# EAGLE design DigitalIO (EAGLE 7.7.0)
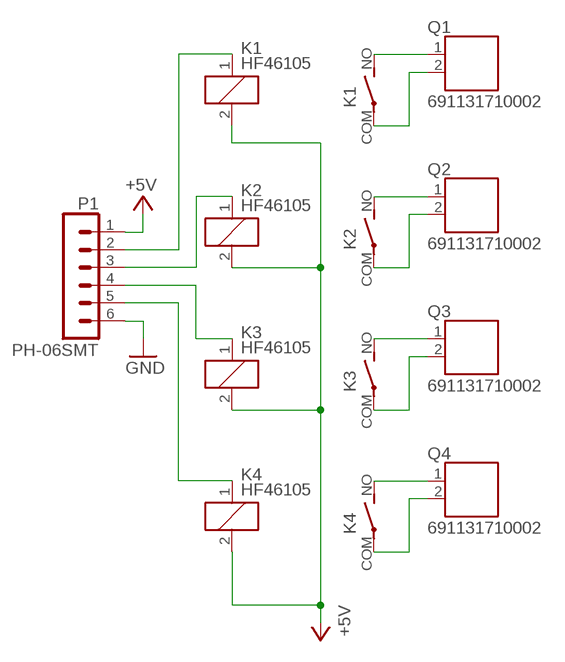
[diagram p0: schematic, sheet 1]

## Parts
K1  HF46105  [HF46]
K2  HF46105  [HF46]
K3  HF46105  [HF46]
K4  HF46105  [HF46]
P1  PH-06SMT  [S6B-PH-SM4]
Q1  691131710002  [691131710002]
Q2  691131710002  [691131710002]
Q3  691131710002  [691131710002]
Q4  691131710002  [691131710002]

## Nets
+5V: K1.2 K2.2 K3.2 K4.2 P1.1
GND: P1.6
N$2: K2.1 P1.3
N$4: K4.1 P1.5
N$5: K1.1 P1.2
N$6: K1.NO(2:S) Q1.1
N$7: K1.COM(2:P) Q1.2
N$8: K2.NO(2:S) Q2.1
N$9: K2.COM(2:P) Q2.2
N$10: K3.NO(2:S) Q3.1
N$11: K3.COM(2:P) Q3.2
N$12: K4.NO(2:S) Q4.1
N$13: K4.COM(2:P) Q4.2
N$14: K3.1 P1.4

## Library data of the parts
K1-K4 = hongfa:HF46?*: Slim Power Relay NAiS Source: http://www.hongfa.com/pro/pdf/HF46F_en.pdf; OC_FARNELL: unknown; OC_NEWARK: unknown
P1 = con-jst-ph:PH-06: HEADER
Q1-Q4 = con-wuerth:691131710002: WR-TBL Terminal block - CUU5/2 CUU5/2GR - 2 Pins;=>Code : Con_TBL_Screw_PClamp_5.00_6911317100xx_691131710002 <http://katalog.we-online.de/media/images/eican/Con_TBL_Screw_PClamp_5.00_6911317100xx_pf2.jpg> Details see: http://katalog.we-online.de/em/datasheet/6911317100xx.pdf Created 11/23/2014, Karrer Zheng 2014 (C) Wurth Elektronik

## Board
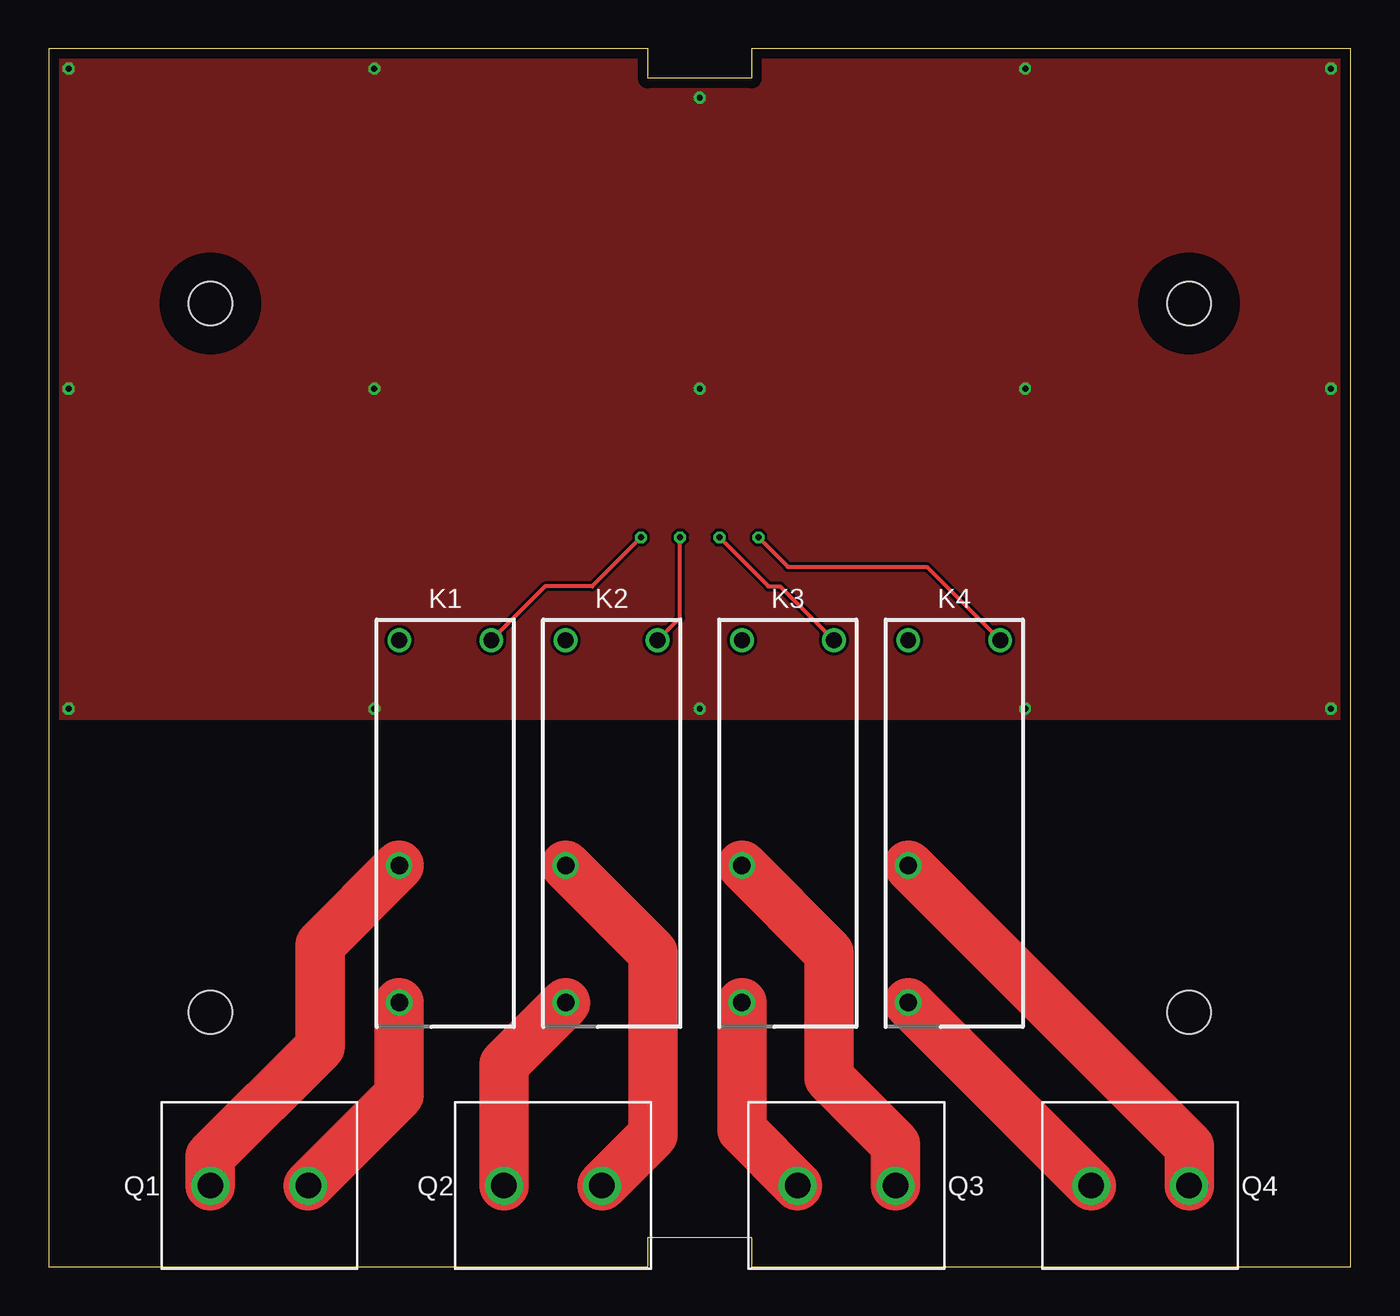
[diagram p1: board, top side]
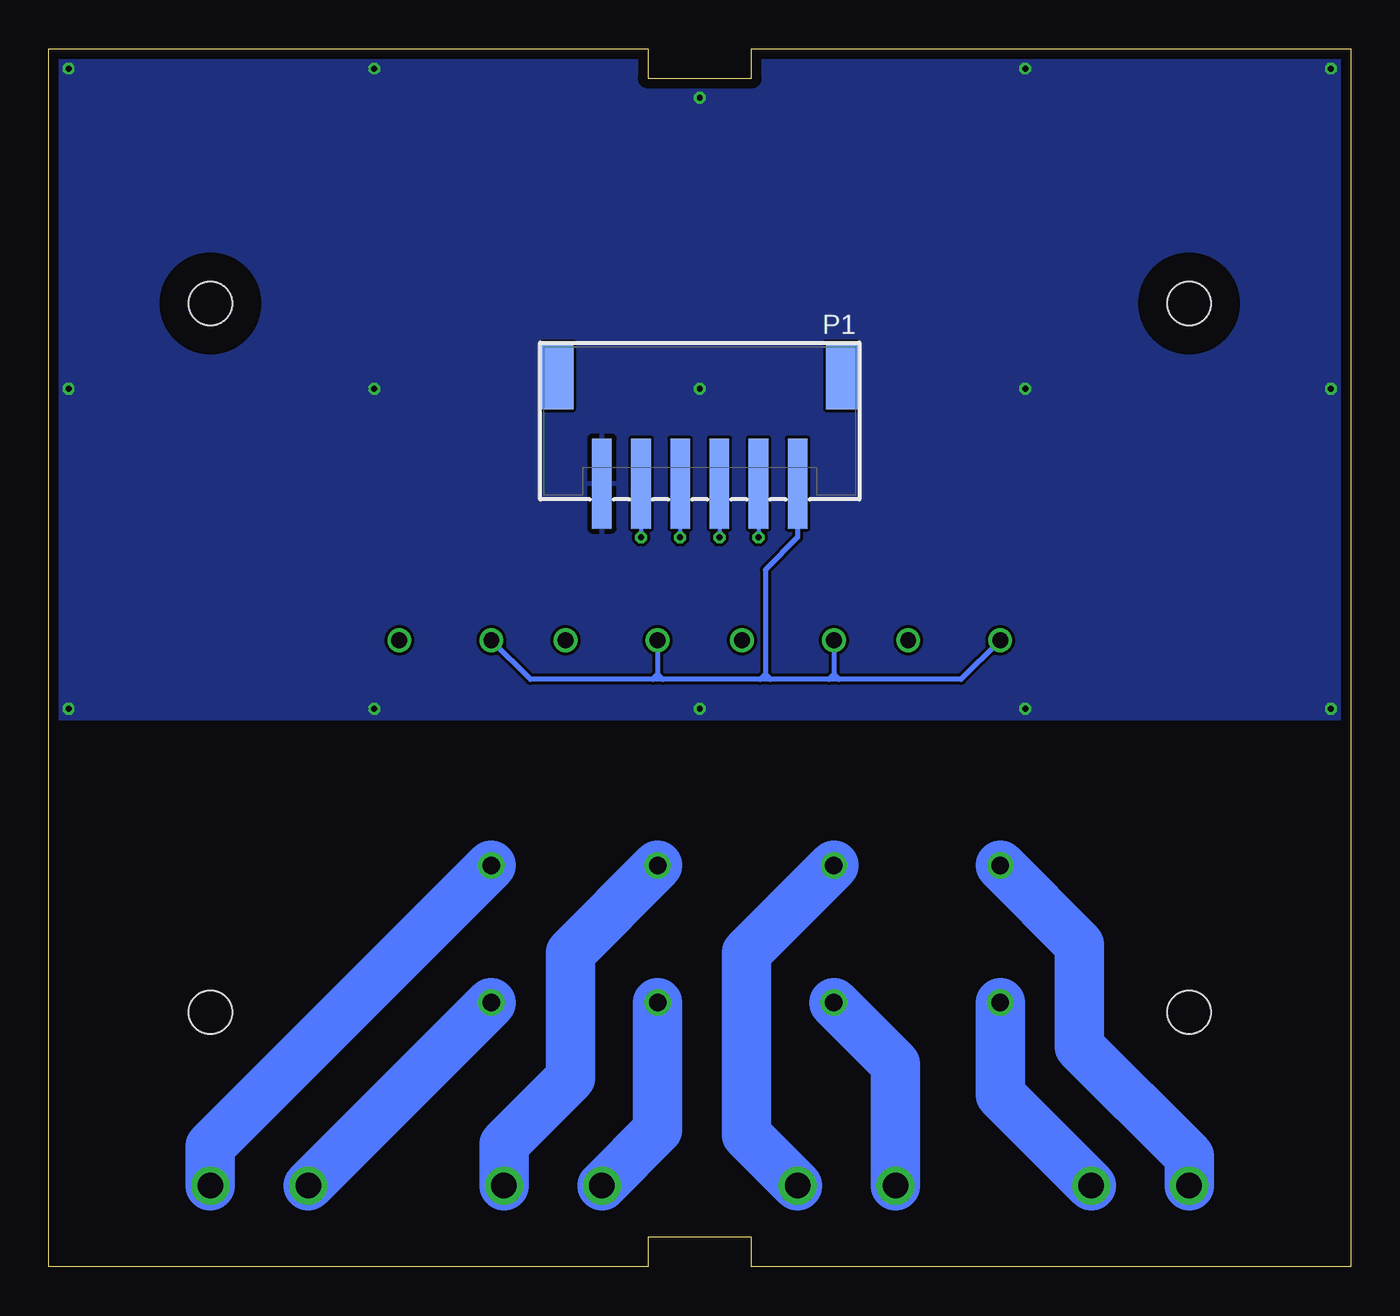
[diagram p2: board, bottom side, seen from below]

Size 66.5 x 62.2 mm. Coordinates in mm from the lower left corner, seen from the top.
Outline: 0,0 30.6,0 30.6,1.5 35.9,1.5 35.9,0 66.5,0 66.5,62.2 35.9,62.2 35.9,60.7 30.6,60.7 30.6,62.2 0,62.2 0,0
Copper layers (1*16): Top 0.035mm / dielectric 1.6mm / Bottom 0.035mm
Design rules "Elecrow *": minimum track width 6mil, minimum drill 12mil, track to track 6mil, track to pad 6mil, pad to pad 6mil, via to via 8mil, smd to smd 0mil, copper to edge 20mil, drill to drill 10mil, minimum pad ring 6mil, minimum via ring 6mil, stop-mask expansion 0mil, vias tented up to drill 100mil, thermal gap 10mil
Holes 2.2 mm at 8.25,49.2 58.25,13 8.25,13 58.25,49.2
tRestrict: area 5.7,10.4 to 10.8,15.6; area 55.6,10.4 to 60.9,15.6; area 55.6,46.6 to 60.9,51.8; area 5.7,46.6 to 10.8,51.8; 8 lines
bRestrict: area 5.7,10.4 to 10.8,15.6; area 55.6,10.4 to 60.9,15.6; area 55.6,46.6 to 60.9,51.8; area 5.7,46.6 to 10.8,51.8; 4 lines

### Footprints (pad centres in the part's own frame; a part is rotated, then mirrored left to right if it is on the bottom)
HF46 = drill 0.813: 1 -9.35,2.35; 2 -9.35,-2.35 | drill 0.889: COM 2.15,-2.35 | drill 0.9: NO 9.15,-2.35
S6B-PH-SM4 = smd 1 x 4.6: 1 -5,1; 2 -3,1; 3 -1,1; 4 1,1; 5 3,1; 6 5,1 | smd 1.6 x 3.4: NC1 -7.25,-4.5; NC2 7.25,-4.5
691131710002 = drill 1.3: 1 -2.5,0; 2 2.5,0

### Placement (x,y rotation side)
K1  20.25,22.65 270 top
K2  28.75,22.65 270 top
K3  37.75,22.65 270 top
K4  46.25,22.65 270 top
P1  33.25,41 180 bottom
Q1  10.75,4.15 180 top
Q2  25.75,4.15 0 top
Q3  40.75,4.15 0 top
Q4  55.75,4.15 0 top

### Tracks (layer width: path | path; a pad name or v marks a point on that pad's centre or on a via)
+5V
  Bottom 0.254: 26.15,30 19.9,30 K1.2 | 26.15,30 26.65,30 | 26.65,30 29.65,30 | 29.65,30 30.15,30 | 30.15,30 35.15,30 | 35.15,30 35.65,30 | 35.65,30 41.9,30 K4.2 | P1.1 28.25,37.25 29.9,35.6 29.9,30.25 | 26.4,30.25 26.65,30 | K2.2 26.4,30.25 | 26.4,30.25 26.15,30 | 35.4,30.25 35.65,30 | K3.2 35.4,30.25 | 35.4,30.25 35.15,30 | 29.9,30.25 29.65,30 | 29.9,30.25 30.15,30
GND  (via drill 0.3)
  other vias: 1,61.2 1,44.85 1,28.5 16.62,61.2 16.62,44.85 16.62,28.5 33.25,59.7 33.25,44.85 33.25,28.5 49.88,61.2 49.88,44.85 49.88,28.5 65.5,61.2 65.5,44.85 65.5,28.5
  pour Top (rank 2): 0,62.2 30.6,62.2 30.6,60.7 35.9,60.7 35.9,62.2 66.5,62.2 66.5,28 35.9,28 30.6,28 0,28
  pour Bottom (rank 2): 0,62.2 30.6,62.2 30.6,60.7 35.9,60.7 35.9,62.2 66.5,62.2 66.5,28 35.9,28 30.6,28 0,28
N$2  (via drill 0.3)
  Top 0.203: K2.1 32.25,33.15 v32.25,37.25
  Bottom 0.203: P1.3 v32.25,37.25
N$4  (via drill 0.3)
  Top 0.203: K4.1 44.85,35.75 37.75,35.75 v36.25,37.25
  Bottom 0.203: P1.5 v36.25,37.25
N$5  (via drill 0.3)
  Top 0.203: K1.1 25.35,34.75 27.75,34.75 v30.25,37.25
  Bottom 0.203: P1.2 v30.25,37.25
N$6
  Top 2.54: K1.NO 17.9,8.8 Q1.1
  Bottom 2.54: K1.NO 17.9,8.8 Q1.1
N$7
  Top 2.54: Q1.2 8.25,5.65 13.85,11.25 13.85,16.45 K1.COM
  Bottom 2.54: K1.COM 13.85,16.45 13.85,11.25 8.25,5.65 Q1.2
N$8
  Top 2.54: K2.NO 23.25,10.35 Q2.1
  Bottom 2.54: K2.NO 23.25,10.35 Q2.1
N$9
  Top 2.54: Q2.2 30.85,6.75 30.85,16.05 K2.COM
  Bottom 2.54: Q2.2 30.85,6.75 30.85,16.05 K2.COM
N$10
  Top 2.54: K3.NO 35.4,7 Q3.1
  Bottom 2.54: K3.NO 35.4,7 Q3.1
N$11
  Top 2.54: K3.COM 39.85,16.05 39.85,9.67 43.25,6.27 Q3.2
  Bottom 2.54: K3.COM 39.85,16.05 39.85,9.67 43.25,6.27 Q3.2
N$12
  Top 2.54: K4.NO Q4.1
  Bottom 2.54: K4.NO Q4.1
N$13
  Top 2.54: K4.COM 58.25,6.15 Q4.2
  Bottom 2.54: K4.COM 58.25,6.15 Q4.2
N$14  (via drill 0.3)
  Top 0.203: K3.1 37.35,34.75 36.75,34.75 v34.25,37.25
  Bottom 0.203: P1.4 v34.25,37.25

### Text on the board
bDocu: 8DI/8DO